# Altium schematic sheet 3-RF Frontend.SchDoc: RF Frontend
size B; CompanyName: NGRF; Address1: 2130 Howard Drive W; Address2: North Mankato, MN 56003; Address3: www.nextgenrf.com; Revision: 2; SheetNumber: 3; SheetTotal: 7; ProjName: BytePipe X9002_HDK
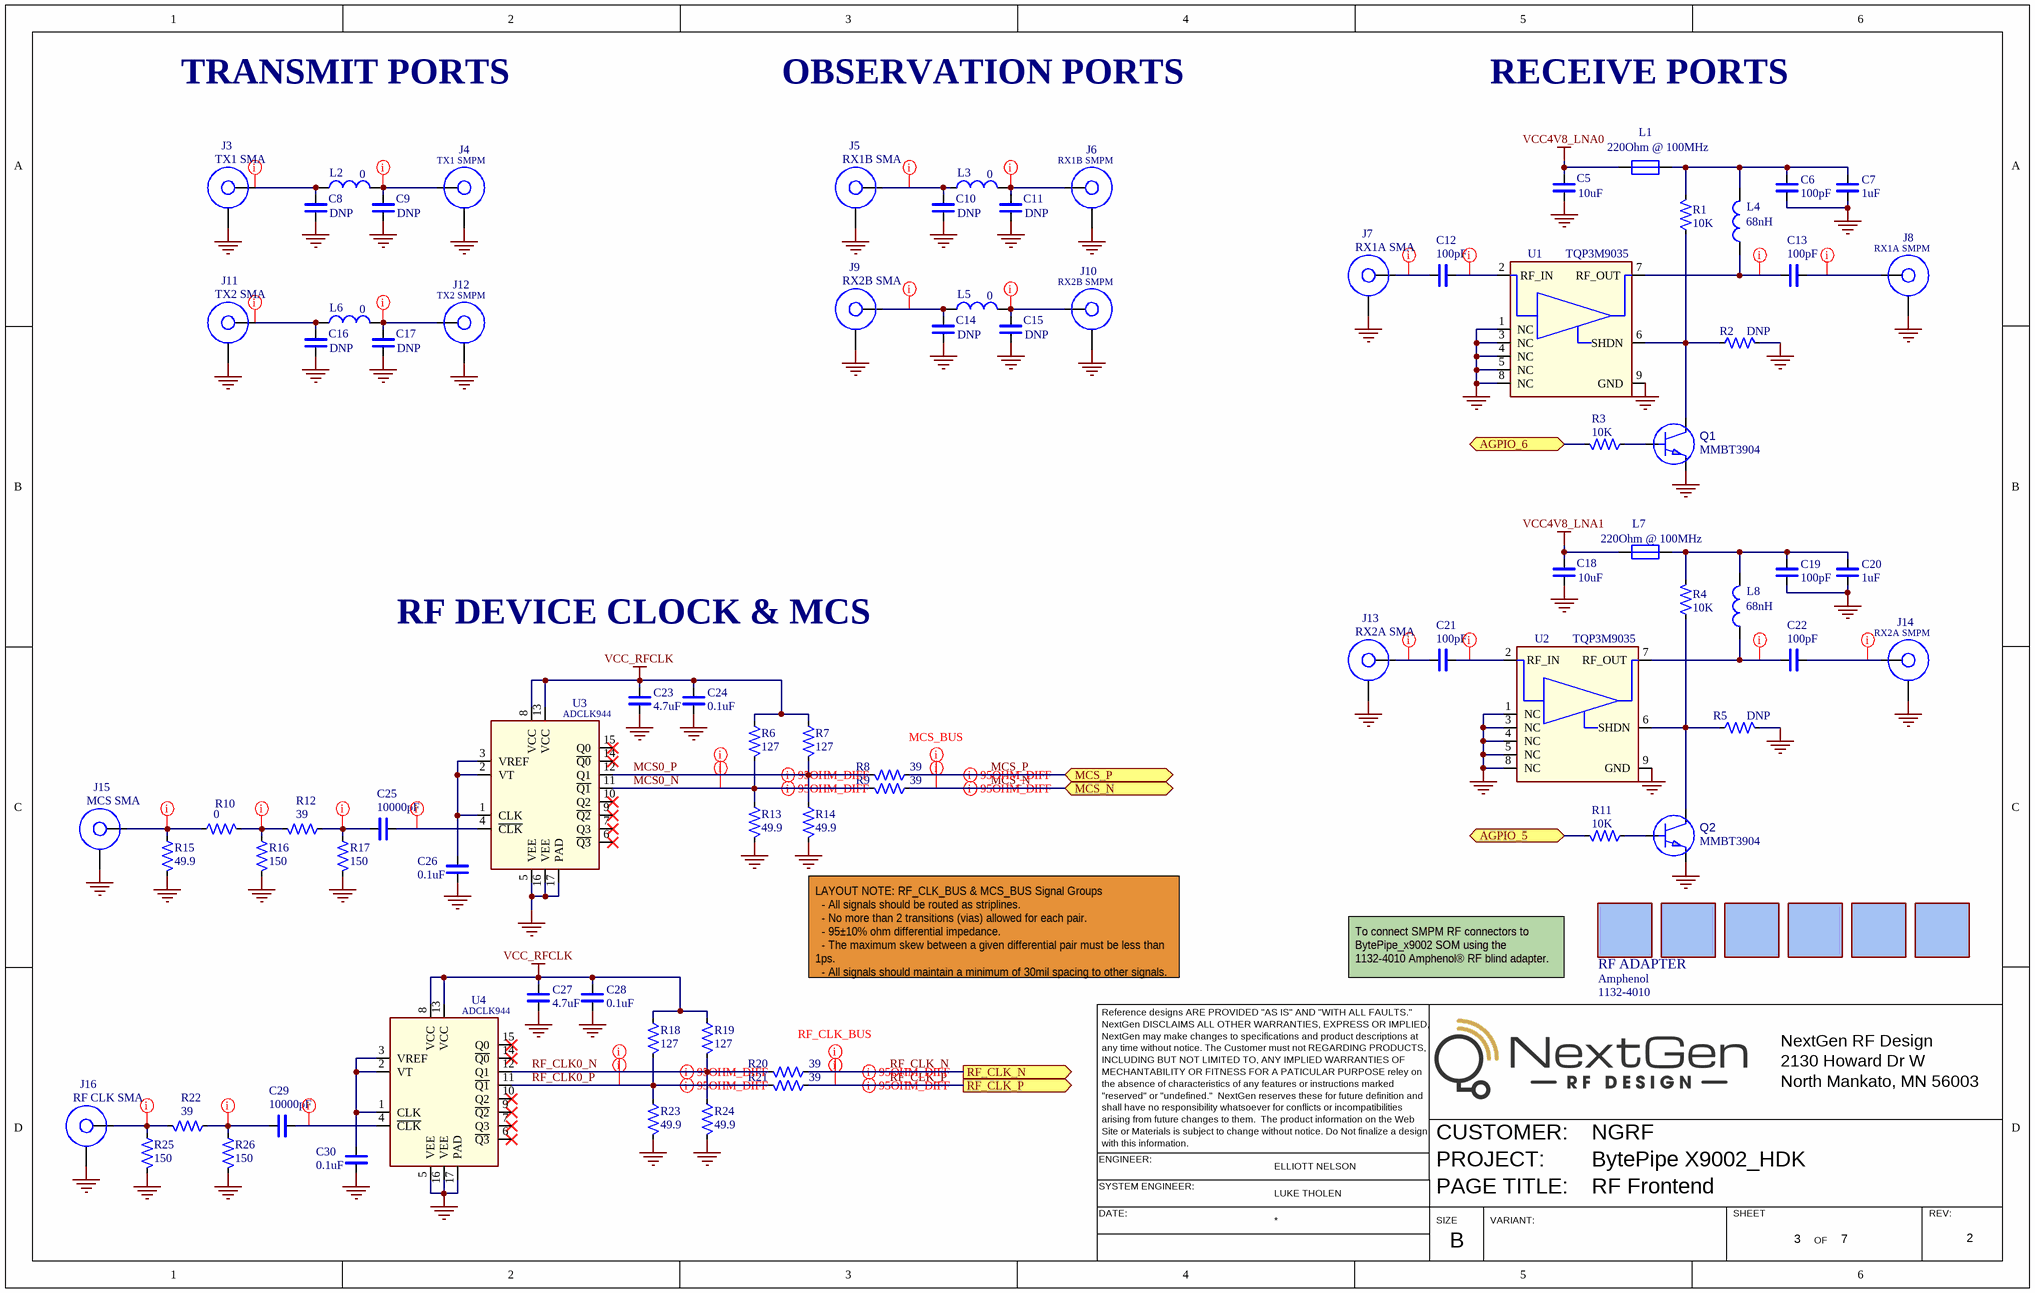
[diagram p0: 3-RF Frontend.SchDoc]

## Parts
B3  RF ADAPTER  OEM NAME: Amphenol  OEM#: 1132-4010
B4  RF ADAPTER  (value not drawn)
B5  RF ADAPTER  (value not drawn)
B6  RF ADAPTER  (value not drawn)
B7  RF ADAPTER  (value not drawn)
B8  RF ADAPTER  (value not drawn)
C5  value 10uF  [SM/0402/CAP]  (hidden comment: CAP_CERAMIC_0402)
C6  value 100pF  [SM/0402/CAP]  (hidden comment: CAP_CERAMIC_0402)
C7  value 1uF  [SM/0402/CAP]  (hidden comment: CAP_CERAMIC_0402)
C8  value DNP  [SM/0402/CAP]  (hidden comment: CAP_CERAMIC_0402)
C9  value DNP  [SM/0402/CAP]  (hidden comment: CAP_CERAMIC_0402)
C10  value DNP  [SM/0402/CAP]  (hidden comment: CAP_CERAMIC_0402)
C11  value DNP  [SM/0402/CAP]  (hidden comment: CAP_CERAMIC_0402)
C12  value 100pF  [SM/0402/CAP]  (hidden comment: CAP_CERAMIC_0402)
C13  value 100pF  [SM/0402/CAP]  (hidden comment: CAP_CERAMIC_0402)
C14  value DNP  [SM/0402/CAP]  (hidden comment: CAP_CERAMIC_0402)
C15  value DNP  [SM/0402/CAP]  (hidden comment: CAP_CERAMIC_0402)
C16  value DNP  [SM/0402/CAP]  (hidden comment: CAP_CERAMIC_0402)
C17  value DNP  [SM/0402/CAP]  (hidden comment: CAP_CERAMIC_0402)
C18  value 10uF  [SM/0402/CAP]  (hidden comment: CAP_CERAMIC_0402)
C19  value 100pF  [SM/0402/CAP]  (hidden comment: CAP_CERAMIC_0402)
C20  value 1uF  [SM/0402/CAP]  (hidden comment: CAP_CERAMIC_0402)
C21  value 100pF  [SM/0402/CAP]  (hidden comment: CAP_CERAMIC_0402)
C22  value 100pF  [SM/0402/CAP]  (hidden comment: CAP_CERAMIC_0402)
C23  value 4.7uF  [SM/0402/CAP]  (hidden comment: CAP_CERAMIC_0402)
C24  value 0.1uF  [SM/0402/CAP]  (hidden comment: CAP_CERAMIC_0402)
C25  value 10000pF  [SM/0402/CAP]  (hidden comment: CAP_CERAMIC_0402)
C26  value 0.1uF  [SM/0402/CAP]  (hidden comment: CAP_CERAMIC_0402)
C27  value 4.7uF  [SM/0402/CAP]  (hidden comment: CAP_CERAMIC_0402)
C28  value 0.1uF  [SM/0402/CAP]  (hidden comment: CAP_CERAMIC_0402)
C29  value 10000pF  [SM/0402/CAP]  (hidden comment: CAP_CERAMIC_0402)
C30  value 0.1uF  [SM/0402/CAP]  (hidden comment: CAP_CERAMIC_0402)
J3  value TX1 SMA  [SM/CON/RF/SMA/BRD-EDGE_C]  (hidden comment: CON_RF_SMA_BRD-EDGE_C)
J4  value TX1 SMPM  [SM/CON/RF/SMPM/VERT_A]  (hidden comment: CON_RF_SMPM_SMT_AMPHENOL)
J5  value RX1B SMA  [SM/CON/RF/SMA/BRD-EDGE_C]  (hidden comment: CON_RF_SMA_BRD-EDGE_C)
J6  value RX1B SMPM  [SM/CON/RF/SMPM/VERT_A]  (hidden comment: CON_RF_SMPM_SMT_AMPHENOL)
J7  value RX1A SMA  [SM/CON/RF/SMA/BRD-EDGE_C]  (hidden comment: CON_RF_SMA_BRD-EDGE_C)
J8  value RX1A SMPM  [SM/CON/RF/SMPM/VERT_A]  (hidden comment: CON_RF_SMPM_SMT_AMPHENOL)
J9  value RX2B SMA  [SM/CON/RF/SMA/BRD-EDGE_C]  (hidden comment: CON_RF_SMA_BRD-EDGE_C)
J10  value RX2B SMPM  [SM/CON/RF/SMPM/VERT_A]  (hidden comment: CON_RF_SMPM_SMT_AMPHENOL)
J11  value TX2 SMA  [SM/CON/RF/SMA/BRD-EDGE_C]  (hidden comment: CON_RF_SMA_BRD-EDGE_C)
J12  value TX2 SMPM  [SM/CON/RF/SMPM/VERT_A]  (hidden comment: CON_RF_SMPM_SMT_AMPHENOL)
J13  value RX2A SMA  [SM/CON/RF/SMA/BRD-EDGE_C]  (hidden comment: CON_RF_SMA_BRD-EDGE_C)
J14  value RX2A SMPM  [SM/CON/RF/SMPM/VERT_A]  (hidden comment: CON_RF_SMPM_SMT_AMPHENOL)
J15  value MCS SMA  [SM/CON/RF/SMA/BRD-EDGE_C]  (hidden comment: CON_RF_SMA_BRD-EDGE_C)
J16  value RF CLK SMA  [SM/CON/RF/SMA/BRD-EDGE_C]  (hidden comment: CON_RF_SMA_BRD-EDGE_C)
L1  value 220Ohm @ 100MHz  [SM/0603]  (hidden comment: FERRITE_0603_A)
L2  value 0  [SM/0402]  (hidden comment: IND_0402)
L3  value 0  [SM/0402]  (hidden comment: IND_0402)
L4  value 68nH  [SM/0603]  (hidden comment: IND_0603)
L5  value 0  [SM/0402]  (hidden comment: IND_0402)
L6  value 0  [SM/0402]  (hidden comment: IND_0402)
L7  value 220Ohm @ 100MHz  [SM/0603]  (hidden comment: FERRITE_0603_A)
L8  value 68nH  [SM/0603]  (hidden comment: IND_0603)
Q1  value MMBT3904  [SM/SOT23_A]  (hidden comment: TRANSISTOR_NPN_SOT23)
Q2  value MMBT3904  [SM/SOT23_A]  (hidden comment: TRANSISTOR_NPN_SOT23)
R1  value 10K  [SM/0402/RES]  (hidden comment: RES_0402_A)
R2  value DNP  [SM/0402/RES]  (hidden comment: RES_0402_A)
R3  value 10K  [SM/0402/RES]  (hidden comment: RES_0402_A)
R4  value 10K  [SM/0402/RES]  (hidden comment: RES_0402_A)
R5  value DNP  [SM/0402/RES]  (hidden comment: RES_0402_A)
R6  value 127  [SM/0402/RES]  (hidden comment: RES_0402_A)
R7  value 127  [SM/0402/RES]  (hidden comment: RES_0402_A)
R8  value 39  [SM/0402/RES]  (hidden comment: RES_0402_A)
R9  value 39  [SM/0402/RES]  (hidden comment: RES_0402_A)
R10  value 0  [SM/0402/RES]  (hidden comment: RES_0402_A)
R11  value 10K  [SM/0402/RES]  (hidden comment: RES_0402_A)
R12  value 39  [SM/0402/RES]  (hidden comment: RES_0402_A)
R13  value 49.9  [SM/0402/RES]  (hidden comment: RES_0402_A)
R14  value 49.9  [SM/0402/RES]  (hidden comment: RES_0402_A)
R15  value 49.9  [SM/0402/RES]  (hidden comment: RES_0402_A)
R16  value 150  [SM/0402/RES]  (hidden comment: RES_0402_A)
R17  value 150  [SM/0402/RES]  (hidden comment: RES_0402_A)
R18  value 127  [SM/0402/RES]  (hidden comment: RES_0402_A)
R19  value 127  [SM/0402/RES]  (hidden comment: RES_0402_A)
R20  value 39  [SM/0402/RES]  (hidden comment: RES_0402_A)
R21  value 39  [SM/0402/RES]  (hidden comment: RES_0402_A)
R22  value 39  [SM/0402/RES]  (hidden comment: RES_0402_A)
R23  value 49.9  [SM/0402/RES]  (hidden comment: RES_0402_A)
R24  value 49.9  [SM/0402/RES]  (hidden comment: RES_0402_A)
R25  value 150  [SM/0402/RES]  (hidden comment: RES_0402_A)
R26  value 150  [SM/0402/RES]  (hidden comment: RES_0402_A)
U1  value TQP3M9035  [SM/DFN8/2X2MM_E]  (hidden comment: IC_TQP3M9035_DFN-8)
U2  value TQP3M9035  [SM/DFN8/2X2MM_E]  (hidden comment: IC_TQP3M9035_DFN-8)
U3  value ADCLK944  [SM/QFN16/3X3/0.5LS_A]  (hidden comment: IC_ADCLK944_QFN16)
U4  value ADCLK944  [SM/QFN16/3X3/0.5LS_A]  (hidden comment: IC_ADCLK944_QFN16)

## Ports
AGPIO_5 (bidir), AGPIO_6 (bidir), MCS_N (bidir), MCS_P (bidir), RF_CLK_N (out), RF_CLK_P (out)

## Nets
GND: C5.2(N2) C6.2(N2) C7.2(N2) C8.2(N2) C9.2(N2) C10.2(N2) C11.2(N2) C14.2(N2) C15.2(N2) C16.2(N2) C17.2(N2) C18.2(N2) C19.2(N2) C20.2(N2) C23.2(N2) C24.2(N2) C26.2(N2) C27.2(N2) C28.2(N2) C30.2(N2) J3.2 J4.2 J5.2 J6.2 J7.2 J8.2 J9.2 J10.2 J11.2 J12.2 J13.2 J14.2 J15.2 J16.2 Q1.2(E) Q2.2(E) R2.1 R5.1 R13.2 R14.2 R15.2 R16.2 R17.2 R23.2 R24.2 R25.2 R26.2 U1.1(NC) U1.3(NC) U1.4(NC) U1.5(NC) U1.8(NC) U1.9(GND) U2.1(NC) U2.3(NC) U2.4(NC) U2.5(NC) U2.8(NC) U2.9(GND) U3.5(VEE) U3.16(VEE) U3.17(PAD) U4.5(VEE) U4.16(VEE) U4.17(PAD)
VCC4V8_LNA0: C5.1(N1) L1.1(PIN1)
VCC4V8_LNA1: C18.1(N1) L7.1(PIN1)
VCC_RFCLK: C23.1(N1) C24.1(N1) C27.1(N1) C28.1(N1) R6.1 R7.1 R18.1 R19.1 U3.8(VCC) U3.13(VCC) U4.8(VCC) U4.13(VCC)
AGPIO_5: R11.1 ; port AGPIO_5
AGPIO_6: R3.1 ; port AGPIO_6
MCS0_N: R6.2 R9.2 R13.1 U3.11(~{Q1})
MCS0_P: R7.2 R8.2 R14.1 U3.12(Q1)
MCS_N: R9.1 ; port MCS_N
MCS_P: R8.1 ; port MCS_P
RF_CLK0_N: R19.2 R20.2 R24.1 U4.12(Q1)
RF_CLK0_P: R18.2 R21.2 R23.1 U4.11(~{Q1})
RF_CLK_N: R20.1 ; port RF_CLK_N
RF_CLK_P: R21.1 ; port RF_CLK_P
NetC6_1: C6.1(N1) C7.1(N1) L1.2(PIN2) L4.2(PIN2) R1.1
NetC8_1: C8.1(N1) J3.1 L2.1(PIN1)
NetC9_1: C9.1(N1) J4.1 L2.2(PIN2)
NetC10_1: C10.1(N1) J5.1 L3.1(PIN1)
NetC11_1: C11.1(N1) J6.1 L3.2(PIN2)
NetC12_1: C12.1(N1) J7.1
NetC12_2: C12.2(N2) U1.2(RF_IN)
NetC13_1: C13.1(N1) L4.1(PIN1) U1.7(RF_OUT)
NetC13_2: C13.2(N2) J8.1
NetC14_1: C14.1(N1) J9.1 L5.1(PIN1)
NetC15_1: C15.1(N1) J10.1 L5.2(PIN2)
NetC16_1: C16.1(N1) J11.1 L6.1(PIN1)
NetC17_1: C17.1(N1) J12.1 L6.2(PIN2)
NetC19_1: C19.1(N1) C20.1(N1) L7.2(PIN2) L8.2(PIN2) R4.1
NetC21_1: C21.1(N1) J13.1
NetC21_2: C21.2(N2) U2.2(RF_IN)
NetC22_1: C22.1(N1) L8.1(PIN1) U2.7(RF_OUT)
NetC22_2: C22.2(N2) J14.1
NetC25_1: C25.1(N1) R12.1 R17.1
NetC25_2: C25.2(N2) U3.4(~{CLK})
NetC26_1: C26.1(N1) U3.1(CLK) U3.2(VT) U3.3(VREF)
NetC29_1: C29.1(N1) R22.1 R26.1
NetC29_2: C29.2(N2) U4.4(~{CLK})
NetC30_1: C30.1(N1) U4.1(CLK) U4.2(VT) U4.3(VREF)
NetJ15_1: J15.1 R10.2 R15.1
NetJ16_1: J16.1 R22.2 R25.1
NetQ1_1: Q1.1(B) R3.2
NetQ1_3: Q1.3(C) R1.2 R2.2 U1.6(SHDN)
NetQ2_1: Q2.1(B) R11.2
NetQ2_3: Q2.3(C) R4.2 R5.2 U2.6(SHDN)
NetR10_1: R10.1 R12.2 R16.1

Not connected (* = marked no-connect by the designer): U3 6(~{Q3})* 7(Q3)* 9(~{Q2})* 10(Q2)* 14(~{Q0})* 15(Q0)*; U4 6(~{Q3})* 7(Q3)* 9(~{Q2})* 10(Q2)* 14(~{Q0})* 15(Q0)*

## Layout directives
net class 50OHM_SE: NetC8_1, NetC9_1, NetC10_1, NetC11_1, NetC12_1, NetC12_2, NetC13_1, NetC13_2, NetC14_1, NetC15_1, NetC16_1, NetC17_1, NetC21_1, NetC21_2, NetC22_1, NetC22_2, NetC25_1, NetC25_2, NetC29_1, NetC29_2, NetJ15_1, NetJ16_1, NetR10_1
differential pair; Impedance: 90 Ohms; differential pair class 95OHM_DIFF: MCS0_N, MCS0_P, MCS_N, MCS_P, RF_CLK0_N, RF_CLK0_P, RF_CLK_N, RF_CLK_P
net class RF_CLK_BUS: RF_CLK0_N, RF_CLK0_P, RF_CLK_N, RF_CLK_P
net class MCS_BUS: MCS0_N, MCS0_P, MCS_N, MCS_P

## Notes on the sheet
- TRANSMIT PORTS
- OBSERVATION PORTS
- RECEIVE PORTS
- RF DEVICE CLOCK & MCS
- (near R14) LAYOUT NOTE: RF_CLK_BUS & MCS_BUS Signal Groups
  - All signals should be routed as striplines.
  - No more than 2 transitions (vias) allowed for each pair.
  - 95±10% ohm differential impedance.
  - The maximum skew between a given differential pair must be less than 1ps.
  - All signals should maintain a minimum of 30mil spacing to other signals.
- (near B3) To connect SMPM RF connectors to BytePipe_x9002 SOM using the 1132-4010 Amphenol® RF blind adapter.
- Reference designs ARE PROVIDED "AS IS" AND "WITH ALL FAULTS."
- NextGen DISCLAIMS ALL OTHER WARRANTIES, EXPRESS OR IMPLIED,
- NextGen may make changes to specifications and product descriptions at
- NextGen RF Design
- any time without notice. The Customer must not REGARDING PRODUCTS,
- INCLUDING BUT NOT LIMITED TO, ANY IMPLIED WARRANTIES OF
- MECHANTABILITY OR FITNESS FOR A PATICULAR PURPOSE reley on
- "reserved" or "undefined."  NextGen reserves these for future definition and
- the absence of characteristics of any features or instructions marked
- shall have no responsibility whatsoever for conflicts or incompatibilities
- 2130 Howard Dr W
- North Mankato, MN 56003
- ENGINEER:
- Site or Materials is subject to change without notice. Do Not finalize a design
- with this information.
- arising from future changes to them.  The product information on the Web
- ELLIOTT NELSON
- CUSTOMER:
- PROJECT:
- SYSTEM ENGINEER:
- DATE:
- LUKE THOLEN
- SIZE
- PAGE TITLE:
- VARIANT:
- SHEET
- OF
- REV:
- B

## Library data of the parts
B3 = BOM_COMPONENT_NO-FOOTPRINT: Amphenol® RF SMPM blind adapter; VALUE: RF ADAPTER
B4-B8 = BOM_COMPONENT_NO-FOOTPRINT: Amphenol® RF SMPM blind adapter; OEM#: 1132-4010; OEM NAME: Amphenol; VALUE: RF ADAPTER
C5 C18 = CAP_CERAMIC_0402: 10µF ±20% 10V Ceramic Capacitor X5R 0402 (1005 Metric); OEM#: CL05A106MP8NUB8; OEM NAME: Samsung; TOL: ±20%; VOLT: 10V
C6 C12 C13 C19 C21 C22 = CAP_CERAMIC_0402: CAP CER 100PF 50V C0G/NP0 0402; TOL: ±5%; OEM#: CL05C101JB5NNNC; OEM NAME: Samsung; VOLT: 50V
C7 C20 = CAP_CERAMIC_0402: CAP CER 1UF 16V X5R 0402; TOL: ±10%; OEM#: CL05A105KO5NNNC; OEM NAME: Samsung; VOLT: 16V
C23 C27 = CAP_CERAMIC_0402: CAP CER 4.7UF 10V X5R 0402; TOL: ±20%; OEM#: CL05A475MP5NRNC; OEM NAME: Samsung; VOLT: 10V
C24 C26 C28 C30 = CAP_CERAMIC_0402: CAP CER 0.1UF 25V X7R 0402; TOL: ±10%; OEM#: CL05B104KA5NNNC; OEM NAME: Samsung; VOLT: 25V
C25 C29 = CAP_CERAMIC_0402: CAP CER 10000PF 50V X7R 0402; TOL: ±10%; OEM#: CL05B103KB5VPNC; OEM NAME: Samsung; VOLT: 50V
J3 J5 J7 J9 J11 J13 J15 J16 = CON_RF_SMA_BRD-EDGE_C: SMA board edge style, .250" wide style; OEM#: 142-0711-821; OEM NAME: Cinch
J4 J6 J8 J10 J12 J14 = CON_RF_SMPM_SMT_AMPHENOL: SMPM Connector Plug, Male Pin 50Ohm Surface Mount Solder. Based off of Amphenol 925-144J-51PT; OEM NAME: AMP; OEM#: 925-144J-51PT
L1 L7 = FERRITE_0603_A: 120 Ohms @ 100MHz 1 Power Line Ferrite Bead 0603 (1608 Metric) 3A 25mOhm; OEM#: BLM18SG221TN1D; OEM NAME: Murata Electronics
L2 L3 L5 L6 = IND_0402: RES SMD 0 OHM JUMPER 1/10W 0402; OEM#: ERJ-2GE0R00X; OEM NAME: Panasonic
L4 L8 = IND_0603: FIXED IND 68NH 300MA 800 MOHM; OEM#: LQG18HH68NJ00D; OEM NAME: Murata
Q1 Q2 = TRANSISTOR_NPN_SOT23: Bipolar (BJT) Transistor NPN 40V 200mA 300MHz 300mW Surface Mount SOT-23-3 (TO-236); OEM#: MMBT3904LT1G; OEM NAME: ON Semiconductor
R1 R3 R4 R11 = RES_0402_A: RES SMD 10K OHM 1% 1/10W 0402; OEM#: ERJ-2RKF1002X; OEM NAME: Panasonic; TOL: ±1%
R6 R7 R18 R19 = RES_0402_A: RES SMD 127 OHM 1% 1/10W 0402; OEM#: ERJ-2RKF1270X; OEM NAME: Panasonic; TOL: 1%
R8 R9 R12 R20-R22 = RES_0402_A: RES SMD 39 OHM 1% 1/10W 0402; OEM#: ERJ-2RKF39R0X; OEM NAME: Panasonic; TOL: 1%
R10 = RES_0402_A: RES SMD 0 OHM JUMPER 1/10W 0402; OEM#: ERJ-2GE0R00X; OEM NAME: Panasonic; TOL: 1%
R13-R15 R23 R24 = RES_0402_A: RES 49.9 OHM 1% 1/10W 0402; OEM#: ERJ-2RKF49R9X; OEM NAME: Panasonic; TOL: ±1%
R16 R17 R25 R26 = RES_0402_A: RES SMD 150 OHM 1% 1/10W 0402; OEM#: ERJ-2RKF1500X; OEM NAME: Panasonic; TOL: ±1%
U1 U2 = IC_TQP3M9035_DFN-8: RF Amplifier 50-4000MHz NF .66dB Gain 16.5dB @1.9GHz; OEM NAME: Qorvo; OEM#: TQP3M9035
U3 U4 = IC_ADCLK944_QFN16: IC CLK BUFFER 1:4 7GHZ 16LFCSP; OEM#: ADCLK944BCPZ-R2; OEM NAME: ANALOG DEVICES
C8-C11 C14-C17 = CAP_CERAMIC_0402: TOL: *; OEM#: DNP; VOLT: *
R2 R5 = RES_0402_A: OEM#: DNP